# EAGLE design schematic (EAGLE 9.5.0)
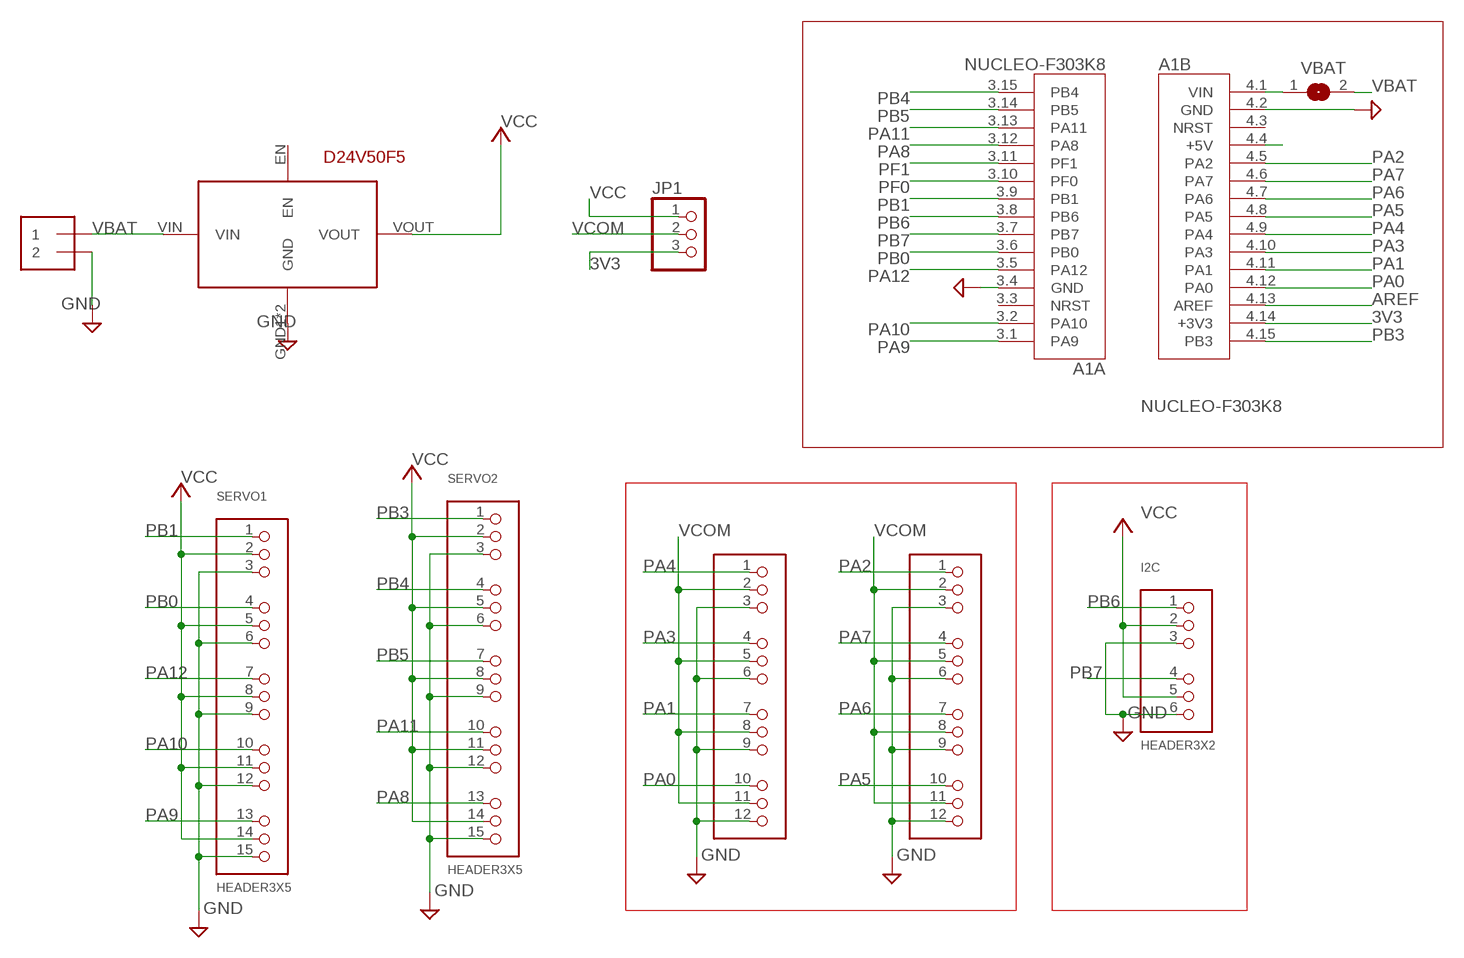
[diagram p0: schematic, sheet 1]

## Parts
A1  NUCLEO-F303K8  [MODULE_NUCLEO-F303K8]
ADC  HEADER-3X04  [3X04]
ADC_DAC  HEADER-3X04  [3X04]
I2C  HEADER3X2  [HEADER3X2]
J1  1X2-3.5MM  [1X2-3.5MM]
JP1  PINHD-1X3  [1X03]
SERVO1  HEADER3X5  [HEADER3X5]
SERVO2  HEADER3X5  [HEADER3X5]
U$1  D24V50F5  [D24V50F5]
VBAT  SJW  [SJW]

## Nets
3V3: A1.4.14(B:+3V3) JP1.3
AREF: A1.4.13(B:AREF)
GND: A1.3.4(A:GND) A1.4.2(B:GND) ADC.3 ADC.6 ADC.9 ADC.12 ADC_DAC.3 ADC_DAC.6 ADC_DAC.9 ADC_DAC.12 I2C.3 I2C.6 J1.2 SERVO1.3 SERVO1.6 SERVO1.9 SERVO1.12 SERVO1.15 SERVO2.3 SERVO2.6 SERVO2.9 SERVO2.12 SERVO2.15 U$1.GND1(GND) U$1.GND2(GND)
N$1: A1.4.1(B:VIN) VBAT.1
N$2: A1.4.4(B:+5V)
PA0: A1.4.12(B:PA0) ADC.10
PA1: A1.4.11(B:PA1) ADC.7
PA2: A1.4.5(B:PA2) ADC_DAC.1
PA3: A1.4.10(B:PA3) ADC.4
PA4: A1.4.9(B:PA4) ADC.1
PA5: A1.4.8(B:PA5) ADC_DAC.10
PA6: A1.4.7(B:PA6) ADC_DAC.7
PA7: A1.4.6(B:PA7) ADC_DAC.4
PA8: A1.3.12(A:PA8) SERVO2.13
PA9: A1.3.1(A:PA9) SERVO1.13
PA10: A1.3.2(A:PA10) SERVO1.10
PA11: A1.3.13(A:PA11) SERVO2.10
PA12: A1.3.5(A:PA12) SERVO1.7
PB0: A1.3.6(A:PB0) SERVO1.4
PB1: A1.3.9(A:PB1) SERVO1.1
PB3: A1.4.15(B:PB3) SERVO2.1
PB4: A1.3.15(A:PB4) SERVO2.4
PB5: A1.3.14(A:PB5) SERVO2.7
PB6: A1.3.8(A:PB6) I2C.1
PB7: A1.3.7(A:PB7) I2C.4
PF0: A1.3.10(A:PF0)
PF1: A1.3.11(A:PF1)
VBAT: J1.1 U$1.VIN VBAT.2
VCC: I2C.2 I2C.5 JP1.1 SERVO1.2 SERVO1.5 SERVO1.8 SERVO1.11 SERVO1.14 SERVO2.2 SERVO2.5 SERVO2.8 SERVO2.11 SERVO2.14 U$1.VOUT
VCOM: ADC.2 ADC.5 ADC.8 ADC.11 ADC_DAC.2 ADC_DAC.5 ADC_DAC.8 ADC_DAC.11 JP1.2
Unconnected: A1.3.3(A:NRST) A1.4.3(B:NRST) U$1.EN

## Library data of the parts
A1 = NUCLEO-F303K8:NUCLEO-F303K8: STM32 Nucleo-32 development board with STM32F303K8T6 MCU, supports Arduino connectivity; AVAILABILITY: Unavailable; DESCRIPTION: STM32 Nucleo-32 development board with STM32F303K8T6 MCU, supports Arduino connectivity; MF: STMicroelectronics; MP: NUCLEO-F303K8; PACKAGE: None; PRICE: None
ADC = microbuilder:HEADER-3X04; SPICEPREFIX: X
ADC_DAC = microbuilder:HEADER-3X04
I2C = lib2:HEADER3X2
J1 = adafruit:1X2: 3.5mm Terminal block http://www.ladyada.net/library/pcb/eaglelibrary.html
JP1 = adafruit:PINHD-1X3: PIN HEADER
SERVO1 SERVO2 = lib2:HEADER3X5
U$1 = lib2:D24V50F5
VBAT = jumper:SJ: SMD solder JUMPER

## Net classes
0 default: width 0.15 mm, drill 0.3 mm, clearance 0.15 mm

## Board
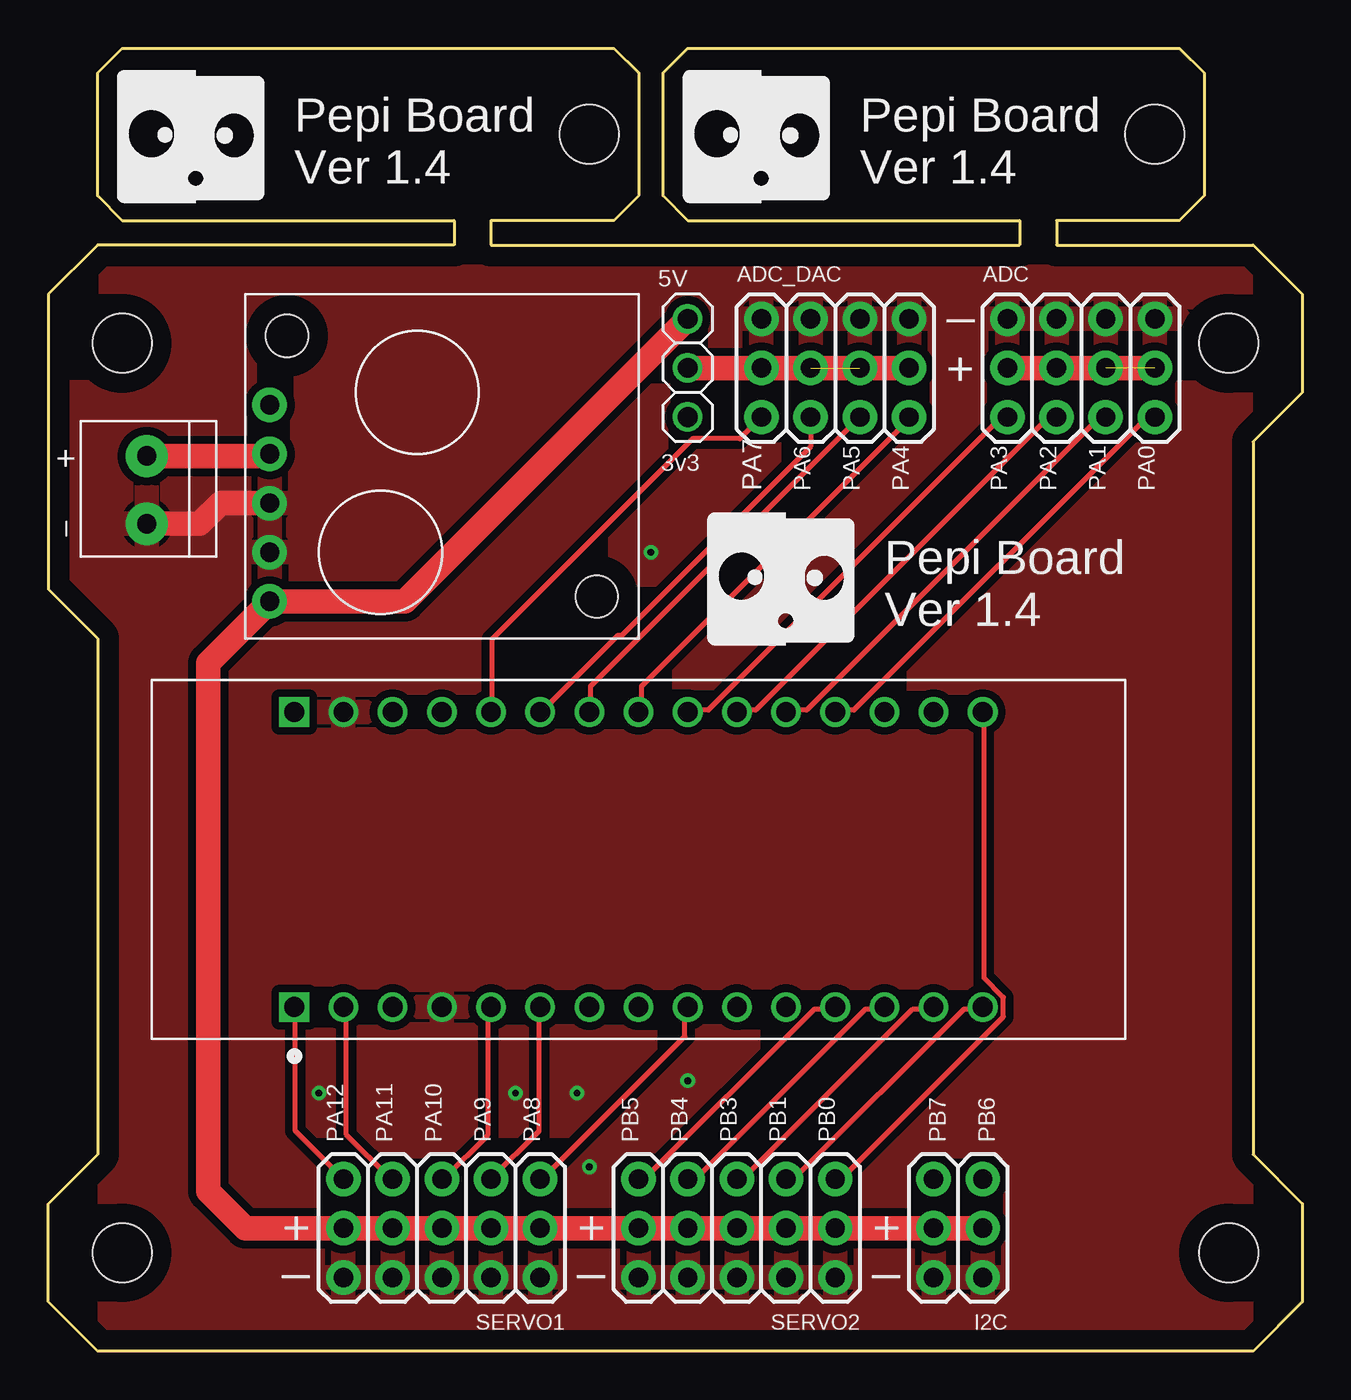
[diagram p1: board, top side]
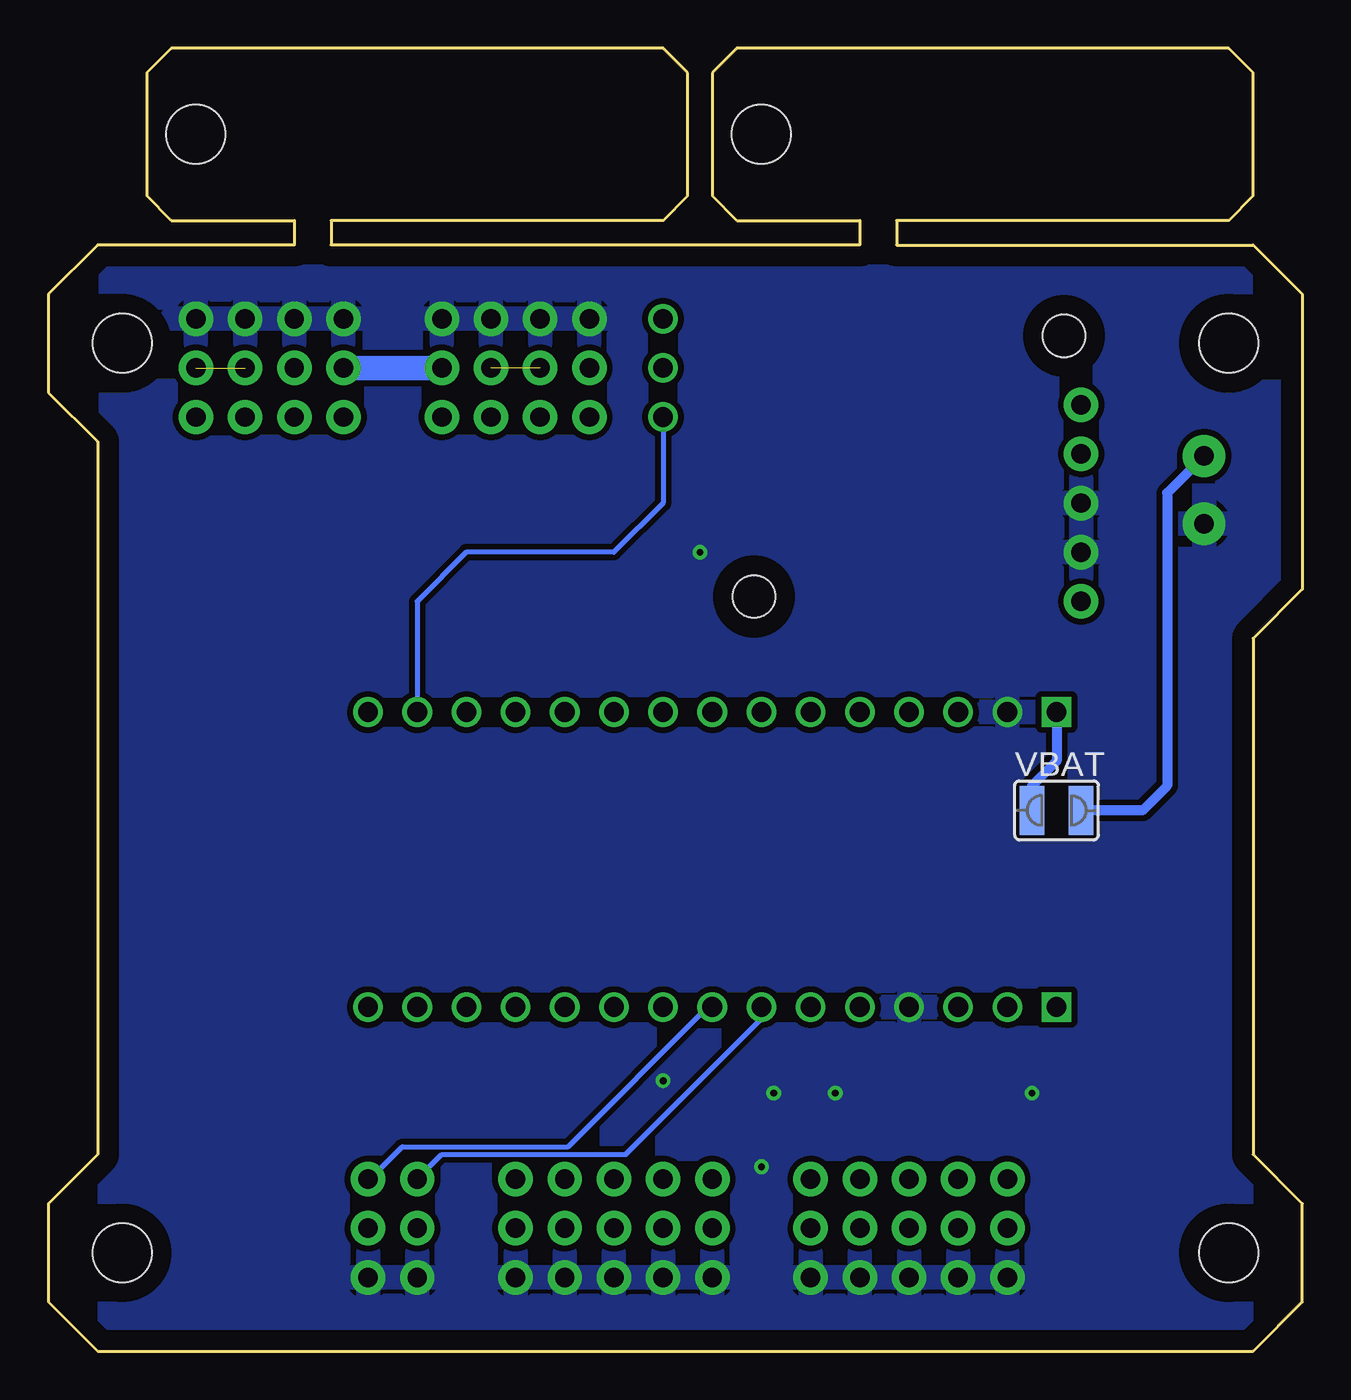
[diagram p2: board, bottom side, seen from below]

Size 64.77 x 67.31 mm. Coordinates in mm from the lower left corner, seen from the top.
Outline: 62.23,46.99 62.23,10.16 64.77,7.62 64.77,2.54 62.23,0 2.54,0 0,2.54 0,7.62 2.54,10.16 2.54,36.83 0,39.37 0,54.61 2.54,57.15 20.95,57.15 20.95,58.42 3.81,58.42 2.54,59.69 2.54,66.04 3.81,67.31 29.21,67.31 30.48,66.04 30.48,59.69 29.21,58.42 22.86,58.42 22.86,57.15 50.16,57.15 50.16,58.42 33.02,58.42 31.75,59.69 31.75,66.04 33.02,67.31 58.42,67.31 59.69,66.04 59.69,59.69 58.42,58.42 52.07,58.42 52.07,57.15 62.23,57.15 64.77,54.61 64.77,49.53 62.23,46.99
Copper layers (1*16): Top 0.035mm / dielectric 1.5mm / Bottom 0.035mm
Design rules "default *": minimum track width 10mil, minimum drill 0.35mm, track to track 6mil, track to pad 6mil, pad to pad 6mil, via to via 6mil, smd to smd 6mil, copper to edge 40mil, drill to drill 6mil, minimum pad ring 10mil, minimum via ring 8mil, stop-mask expansion 4mil, vias tented up to drill 0mil, thermal gap 10mil
Holes 3.05 mm at 3.81,5.08 60.96,5.08 60.96,52.07 3.81,52.07 27.94,62.86 57.15,62.86

### Footprints (pad centres in the part's own frame; a part is rotated, then mirrored left to right if it is on the bottom)
MODULE_NUCLEO-F303K8 = drill 1.02 square: 3.1 -7.62,17.78; 4.1 7.62,17.78 | drill 1.02: 3.2 -7.62,15.24; 3.3 -7.62,12.7; 3.4 -7.62,10.16; 3.5 -7.62,7.62; 3.6 -7.62,5.08; 3.7 -7.62,2.54; 3.8 -7.62,0; 3.9 -7.62,-2.54; 3.10 -7.62,-5.08; 3.11 -7.62,-7.62; 3.12 -7.62,-10.16; 3.13 -7.62,-12.7; 3.14 -7.62,-15.24; 3.15 -7.62,-17.78; 4.2 7.62,15.24; 4.3 7.62,12.7; 4.4 7.62,10.16; 4.5 7.62,7.62; 4.6 7.62,5.08; 4.7 7.62,2.54; 4.8 7.62,0; 4.9 7.62,-2.54; 4.10 7.62,-5.08; 4.11 7.62,-7.62; 4.12 7.62,-10.16; 4.13 7.62,-12.7; 4.14 7.62,-15.24; 4.15 7.62,-17.78
3X04 = drill 1 pad 1.778: 1 -3.81,-2.54; 2 -3.81,0; 3 -3.81,2.54; 4 -1.27,-2.54; 5 -1.27,0; 6 -1.27,2.54; 7 1.27,-2.54; 8 1.27,0; 9 1.27,2.54; 10 3.81,-2.54; 11 3.81,0; 12 3.81,2.54
HEADER3X2 = drill 1 pad 1.778: 1 -3.81,-2.54; 2 -3.81,0; 3 -3.81,2.54; 4 -1.27,-2.54; 5 -1.27,0; 6 -1.27,2.54
1X2-3.5MM = drill 1 pad 2.184: 1 1.8,0; 2 -1.7,0
1X03 = drill 1.016: 1 -2.54,0; 2 0,0; 3 2.54,0
HEADER3X5 = drill 1 pad 1.778: 1 -3.81,-2.54; 2 -3.81,0; 3 -3.81,2.54; 4 -1.27,-2.54; 5 -1.27,0; 6 -1.27,2.54; 7 1.27,-2.54; 8 1.27,0; 9 1.27,2.54; 10 3.81,-2.54; 11 3.81,0; 12 3.81,2.54; 13 6.35,-2.54; 14 6.35,0; 15 6.35,2.54
D24V50F5 = drill 1 pad 1.778: EN -3.175,-8.89; GND1 1.905,-8.89; GND2 4.445,-8.89; VIN -0.635,-8.89; VOUT 6.985,-8.89 | hole 2.184: -6.731,-8.001; 6.731,8.001
SJW = smd 1.27 x 2.54: 1 -1.27,0; 2 1.27,0

### Placement (x,y rotation side)
A1  30.48,25.4 90 top
ADC  53.34,50.8 0 top
ADC_DAC  40.64,50.8 0 top
I2C  44.45,6.35 180 top
J1  5.08,44.45 90 top
JP1  33.02,50.8 270 top
SERVO1  21.59,6.35 180 top
SERVO2  36.83,6.35 180 top
U$1  20.32,45.72 270 top
VBAT  12.7,27.94 0 bottom

### Tracks (layer width: path | path; a pad name or v marks a point on that pad's centre or on a via)
3V3
  Bottom 0.254: JP1.3 33.02,43.81 35.56,41.27 43.18,41.27 45.72,38.73 A1.4.14
GND  (via drill 0.35)
  Top 1.27: J1.2 7.82,42.75 8.89,43.81 U$1.GND1
  other vias: 33.02,13.97 27.94,9.53 13.97,13.34 24.13,13.34 27.3,13.34 31.11,41.27
  pour Bottom (isolate 0.305): 0,0 64.77,0 64.77,67.31 0,67.31
  pour Top (isolate 0.406): -1.27,-1.91 67.95,-1.91 67.95,69.85 -2.54,69.85 -2.54,-1.91 -1.9,-1.91
N$1
  Bottom 0.508: A1.4.1 12.7,30.48 13.97,29.21 VBAT.1
PA0
  Top 0.254: A1.4.12 40.79,33.12 41.61,33.12 56.64,48.16 57.05,48.16 ADC.10
PA1
  Top 0.254: A1.4.11 38.15,33.12 39.17,33.12 54.2,48.16 54.61,48.16 ADC.7
PA2
  Top 0.254: ADC_DAC.1 35.71,47.14 33.27,47.14 22.91,36.78 22.91,33.12 A1.4.5
PA3
  Top 0.254: A1.4.10 35.71,33.12 36.53,33.12 51.56,48.16 51.97,48.16 ADC.4
PA4
  Top 0.254: A1.4.9 33.07,33.12 34.09,33.12 49.12,48.16 49.53,48.16 ADC.1
PA5
  Top 0.254: A1.4.8 30.63,33.12 30.63,34.34 44.45,48.16 ADC_DAC.10
PA6
  Top 0.254: ADC_DAC.7 27.99,34.34 27.99,33.12 A1.4.7
PA7
  Top 0.254: 25.51,33.02 A1.4.6 25.55,33.12 29.41,36.98 29.62,36.98 39.37,46.74 ADC_DAC.4
PA8
  Top 0.254: A1.3.12 40.59,17.68 39.57,17.68 30.63,8.74 SERVO2.13
PA9
  Top 0.254: SERVO1.13 12.75,11.38 12.75,17.68 A1.3.1
PA10
  Top 0.254: A1.3.2 15.39,17.68 15.39,11.18 17.63,8.94 SERVO1.10
PA11
  Top 0.254: A1.3.13 43.03,17.68 42.22,17.68 33.48,8.94 33.07,8.94 SERVO2.10
PA12
  Top 0.254: A1.3.5 22.71,17.68 22.71,11.18 20.47,8.94 SERVO1.7
PB0
  Top 0.254: SERVO1.4 25.35,11.38 25.35,17.68 A1.3.6
PB1
  Top 0.254: A1.3.9 32.87,17.68 32.87,16.26 25.55,8.94 SERVO1.1
PB3
  Top 0.254: A1.4.15 48.31,32.92 48.31,19.3 49.33,18.29 49.33,17.27 40.79,8.74 SERVO2.1
PB4
  Top 0.254: A1.3.15 48.11,17.68 47.3,17.68 38.56,8.94 38.15,8.94 SERVO2.4
PB5
  Top 0.254: A1.3.14 45.67,17.68 44.65,17.68 35.71,8.74 SERVO2.7
PB6
  Bottom 0.254: A1.3.8 30.63,17.68 30.81,17.68 37.92,10.57 46.48,10.57 48.11,8.94 I2C.1
PB7
  Bottom 0.254: A1.3.7 27.94,17.16 34.94,10.16 44.45,10.16 I2C.4
VBAT
  Top 1.27: J1.1 11.32,46.25 U$1.VIN
  Bottom 0.508: J1.1 6.98,44.34 6.98,29.21 8.26,27.94 VBAT.2
VCC
  Top 0.254: SERVO1.11 17.83,6.5 17.83,6.35 | 32.87,6.35 32.87,6.3 SERVO2.11 | SERVO1.8 20.27,6.5 20.27,6.35 | SERVO1.5 22.91,6.5 22.91,6.35 | SERVO1.2 25.35,6.5 25.35,6.35 | SERVO2.14 30.43,6.5 30.43,6.35 | SERVO2.8 35.51,6.5 35.51,6.35 | SERVO2.5 38.15,6.5 38.15,6.35 | SERVO2.2 40.59,6.5 40.59,6.35 | I2C.5 45.67,6.5 45.67,6.35
  Top 1.27: I2C.2 I2C.5 45.67,6.35 SERVO2.2 40.59,6.35 38.15,6.35 SERVO2.5 SERVO2.8 35.51,6.35 SERVO2.11 32.87,6.35 SERVO2.14 30.43,6.35 SERVO1.2 25.35,6.35 22.91,6.35 SERVO1.5 SERVO1.8 20.27,6.35 17.83,6.35 SERVO1.11 SERVO1.14 10.16,6.35 8.26,8.25 8.26,35.56 U$1.VOUT 18.41,38.73 JP1.1
VCOM  (2 unrouted)
  Top 1.27: JP1.2 ADC_DAC.2 ADC_DAC.8 ADC_DAC.11 | ADC.2 ADC.5 ADC.11
  Bottom 1.27: ADC_DAC.11 ADC.2

### Text on the board
tPlace: Pepi Board / Ver 1.4 | Pepi Board / Ver 1.4 | 5V | _ | + | 3v3 | + | PA7 | PA6 | PA5 | PA4 | PA3 | PA2 | PA1 | PA0 | _ | Pepi Board / Ver 1.4 | PA12 | PA11 | PA10 | PA9 | PA8 | PB5 | PB4 | PB3 | PB1 | PB0 | PB7 | PB6 | + | + | + | _ | _ | _